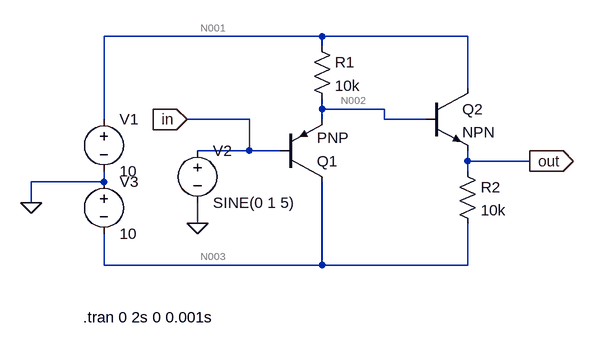
[diagram p0: schematic schemat4.asc]
schemat4.asc, the LTspice schematic file:
Version 4
SHEET 1 880 680
WIRE 0 192 -336 192
WIRE 224 192 0 192
WIRE 0 208 0 192
WIRE 224 272 224 192
WIRE 0 304 0 288
WIRE 96 304 0 304
WIRE -336 320 -336 192
WIRE -112 320 -208 320
WIRE 0 320 0 304
WIRE 96 320 96 304
WIRE 160 320 96 320
WIRE -112 368 -112 320
WIRE -112 368 -192 368
WIRE -64 368 -112 368
WIRE 224 384 224 368
WIRE 320 384 224 384
WIRE 224 400 224 384
WIRE -336 416 -336 400
WIRE -336 416 -448 416
WIRE -448 448 -448 416
WIRE -192 480 -192 448
WIRE -336 544 -336 496
WIRE 0 544 0 416
WIRE 0 544 -336 544
WIRE 224 544 224 480
WIRE 224 544 0 544
FLAG 320 384 out
IOPIN 320 384 Out
FLAG -208 320 in
IOPIN -208 320 In
FLAG -192 480 0
FLAG -448 448 0
SYMBOL voltage -336 304 R0
WINDOW 123 0 0 Left 0
WINDOW 39 0 0 Left 0
SYMATTR InstName V1
SYMATTR Value 10
SYMBOL pnp -64 416 M180
SYMATTR InstName Q1
SYMBOL res -16 192 R0
SYMATTR InstName R1
SYMATTR Value 10k
SYMBOL npn 160 272 R0
SYMATTR InstName Q2
SYMBOL res 208 384 R0
SYMATTR InstName R2
SYMATTR Value 10k
SYMBOL voltage -192 352 R0
WINDOW 123 0 0 Left 0
WINDOW 39 0 0 Left 0
SYMATTR InstName V2
SYMATTR Value SINE(0 1 5)
SYMBOL voltage -336 400 R0
WINDOW 123 0 0 Left 0
WINDOW 39 0 0 Left 0
SYMATTR InstName V3
SYMATTR Value 10
TEXT -368 624 Left 2 !.tran 0 2s 0 0.001s

The netlist it stands for:
* schemat4.asc
V1 N001 0 10
Q1 N003 in N002 0 PNP
R1 N001 N002 10k
Q2 N001 N002 out 0 NPN
R2 out N003 10k
V2 in 0 SINE(0 1 5)
V3 0 N003 10
.model NPN NPN
.model PNP PNP
.lib standard.bjt
.tran 0 2s 0 0.001s
.backanno
.end

* Results of the author's LTspice run, read from the files saved beside the schematic
* Operating Point, zero values left out:
*   V(n001) = 10 V
*   V(n003) = -10 V
*   V(n002) = 771.6 mV
*   V(out) = -2.35 mV
*   Ic(Q1) = -903.9 µA
*   Ib(Q1) = -9.039 µA
*   Ie(Q1) = 912.9 µA
*   Ic(Q2) = 989.9 µA
*   Ib(Q2) = 9.899 µA
*   Ie(Q2) = -999.8 µA
*   I(R1) = 922.8 µA
*   I(R2) = 999.8 µA
*   I(V1) = -1.913 mA
*   I(V2) = 9.039 µA
*   I(V3) = -1.904 mA
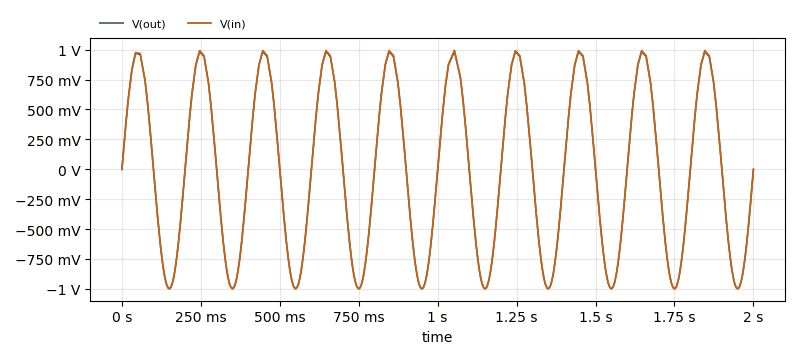
[diagram p1: Transient Analysis of schemat4.asc, plotted from the saved traces]
* Transient Analysis, 1 run:
*   V(out): min -996.7 mV, max 986.6 mV, average -6.184 mV, rms 700.5 mV, last -2.35 mV
*   V(in): min -1 V, max 994.7 mV, average -3.841 mV, rms 704.5 mV, last 0 V